# Altium schematic sheet Conditioner_Array.SchDoc
size A4; SheetNumber: 3; SheetTotal: 8
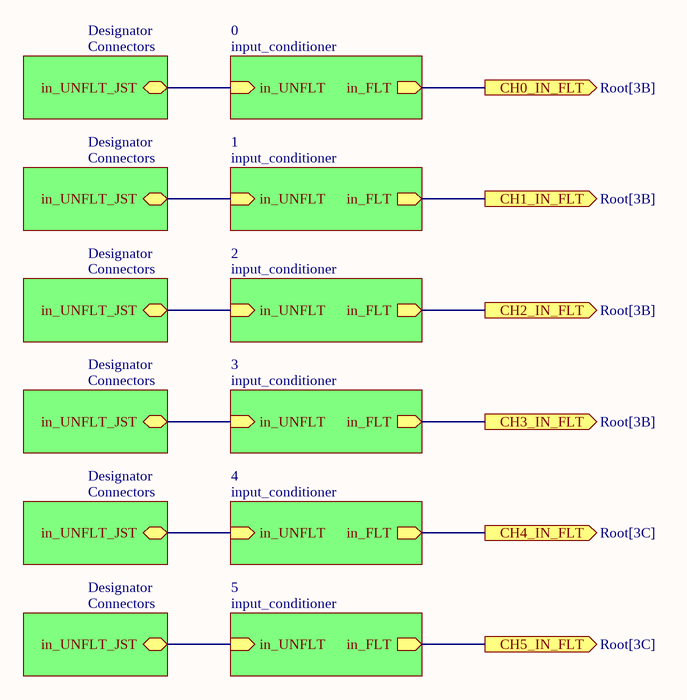
[diagram p0: Conditioner_Array.SchDoc]

## Sub-sheets
0 = input_conditioner: in_UNFLT (in), in_FLT (out)
1 = input_conditioner: in_UNFLT (in), in_FLT (out)
2 = input_conditioner: in_UNFLT (in), in_FLT (out)
3 = input_conditioner: in_UNFLT (in), in_FLT (out)
4 = input_conditioner: in_UNFLT (in), in_FLT (out)
5 = input_conditioner: in_UNFLT (in), in_FLT (out)
Designator = Connectors: in_UNFLT_JST (bidir)
Designator = Connectors: in_UNFLT_JST (bidir)
Designator = Connectors: in_UNFLT_JST (bidir)
Designator = Connectors: in_UNFLT_JST (bidir)
Designator = Connectors: in_UNFLT_JST (bidir)
Designator = Connectors: in_UNFLT_JST (bidir)

## Ports
CH0_IN_FLT (out, see Root[3B]), CH1_IN_FLT (out, see Root[3B]), CH2_IN_FLT (out, see Root[3B]), CH3_IN_FLT (out, see Root[3B]), CH4_IN_FLT (out, see Root[3C]), CH5_IN_FLT (out, see Root[3C])

## Nets
CH0_IN_FLT: port CH0_IN_FLT, sheet 0/in_FLT
CH1_IN_FLT: port CH1_IN_FLT, sheet 1/in_FLT
CH2_IN_FLT: port CH2_IN_FLT, sheet 2/in_FLT
CH3_IN_FLT: port CH3_IN_FLT, sheet 3/in_FLT
CH4_IN_FLT: port CH4_IN_FLT, sheet 4/in_FLT
CH5_IN_FLT: port CH5_IN_FLT, sheet 5/in_FLT
(unnamed): sheet 1/in_UNFLT, sheet Designator/in_UNFLT_JST
(unnamed): sheet 2/in_UNFLT, sheet Designator/in_UNFLT_JST
(unnamed): sheet 3/in_UNFLT, sheet Designator/in_UNFLT_JST
(unnamed): sheet 4/in_UNFLT, sheet Designator/in_UNFLT_JST
(unnamed): sheet 0/in_UNFLT, sheet Designator/in_UNFLT_JST
(unnamed): sheet 5/in_UNFLT, sheet Designator/in_UNFLT_JST